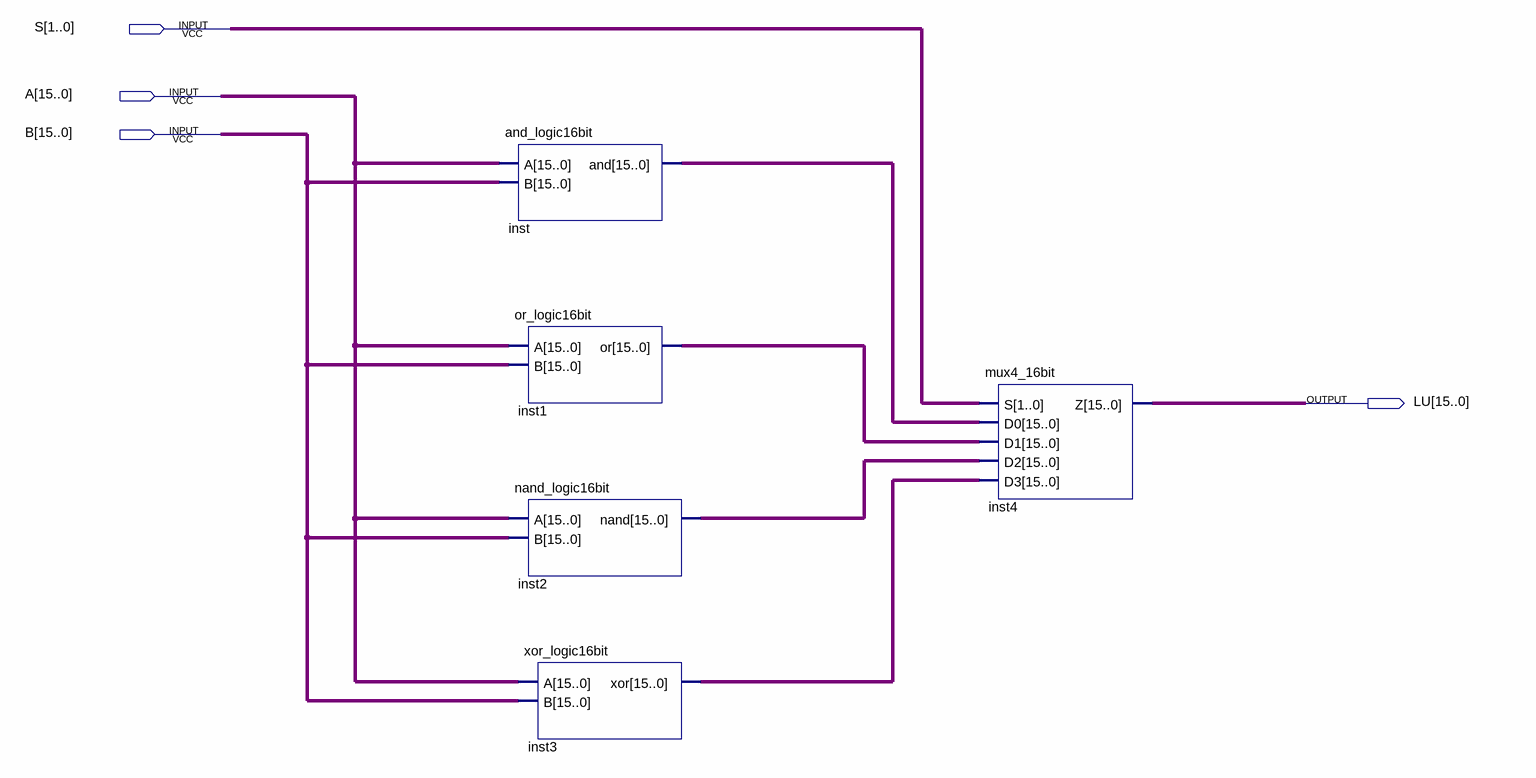
[diagram p0: schematic sheet]
// Quartus schematic LU_16bit.bdf as structural Verilog: 5 symbols, 4 pins
module LU_16bit (
  input  [1:0] S,
  input  [15:0] A,
  input  [15:0] B,
  output [15:0] LU
);

  wire [15:0] inst1_or, inst2_nand, inst3_xor, inst_and;

  and_logic16bit inst (.A(A), .B(B), .\and (inst_and));
  or_logic16bit inst1 (.A(A), .B(B), .\or (inst1_or));
  nand_logic16bit inst2 (.A(A), .B(B), .\nand (inst2_nand));
  xor_logic16bit inst3 (.A(A), .B(B), .\xor (inst3_xor));
  mux4_16bit inst4 (.S(S), .D0(inst_and), .D1(inst1_or), .D2(inst2_nand), .D3(inst3_xor), .Z(LU));
endmodule
